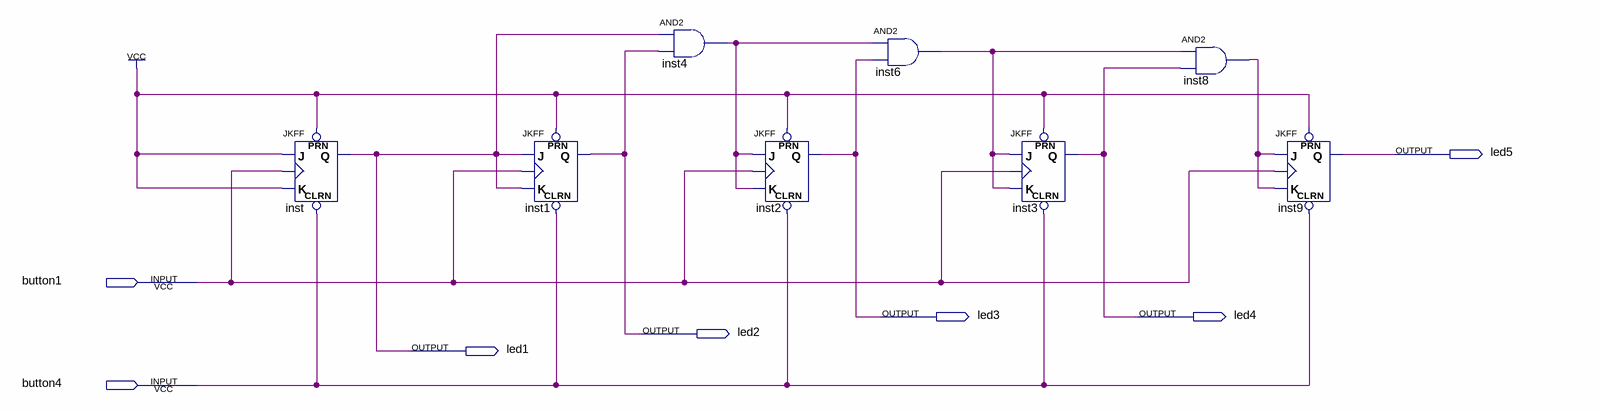
[diagram p0: schematic sheet]
// Quartus schematic Counter_5bit.bdf as structural Verilog: 8 symbols, 7 pins
module Counter_5bit (
  input  button1,
  input  button4,
  output led5,
  output led3,
  output led4,
  output led2,
  output led1
);

  wire inst4_out, inst6_out, inst8_out;

  JKFF inst (.PRN(1'b1), .CLRN(button4), .K(1'b1), .J(1'b1), .CLK(button1), .Q(led1));
  JKFF inst1 (.PRN(1'b1), .CLRN(button4), .K(led1), .J(led1), .CLK(button1), .Q(led2));
  and inst4 (inst4_out, led1, led2);
  JKFF inst2 (.PRN(1'b1), .CLRN(button4), .K(inst4_out), .J(inst4_out), .CLK(button1), .Q(led3));
  and inst6 (inst6_out, inst4_out, led3);
  JKFF inst3 (.PRN(1'b1), .CLRN(button4), .K(inst6_out), .J(inst6_out), .CLK(button1), .Q(led4));
  and inst8 (inst8_out, inst6_out, led4);
  JKFF inst9 (.PRN(1'b1), .CLRN(button4), .K(inst8_out), .J(inst8_out), .CLK(button1), .Q(led5));
endmodule
